# EAGLE design solarSwitch (EAGLE 9.6.2)
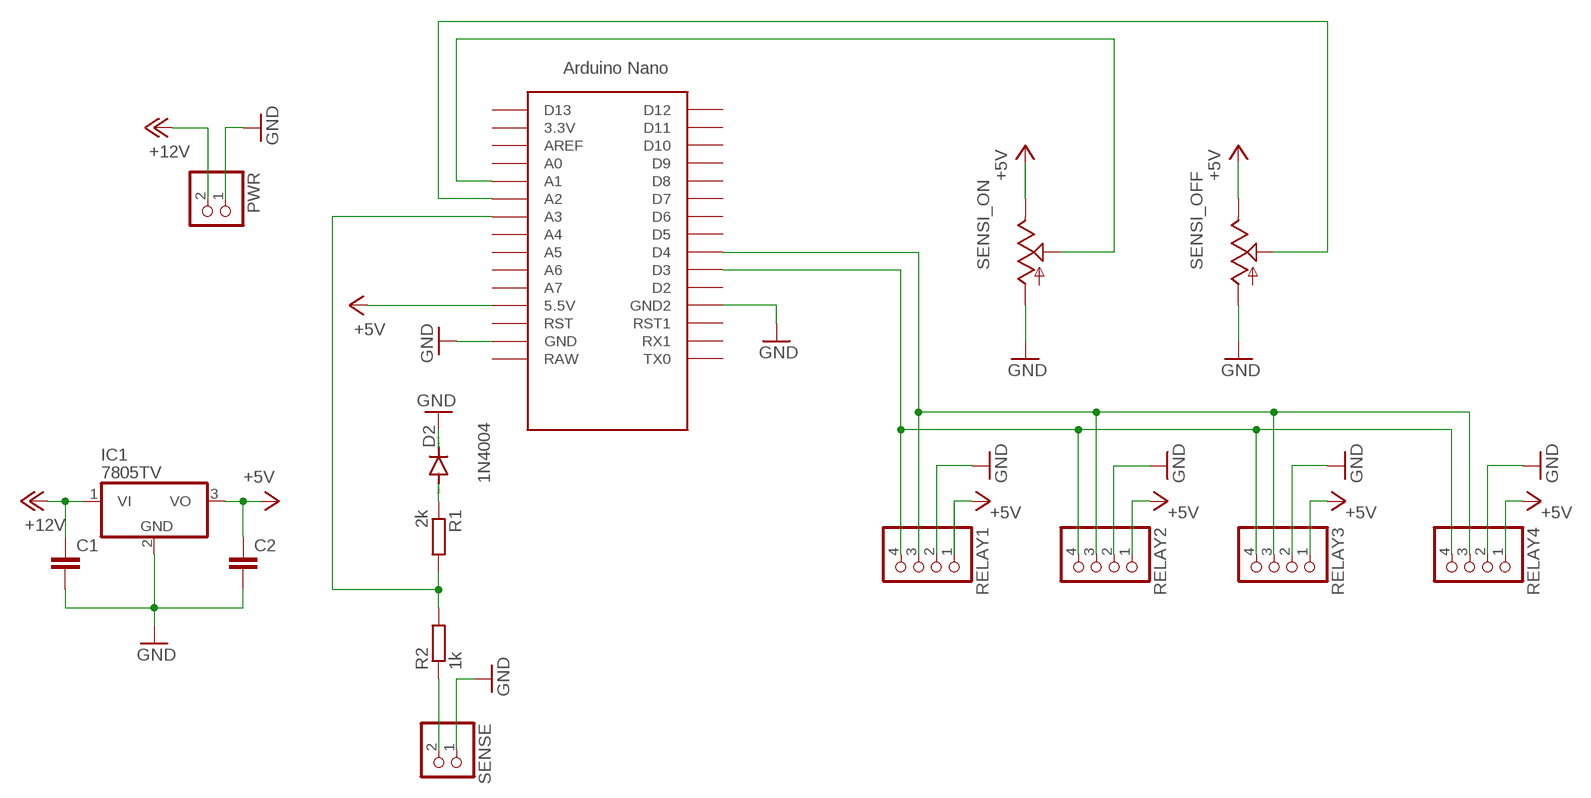
[diagram p0: schematic, sheet 1]

## Parts
C1  C5/3  [C5B3]
C2  C5/3  [C5B3]
D2  1N4004  [DO41-10]
IC1  7805TV  [TO220V]
PWR  PINHD-1X2  [1X02]
R1  2k  R-EU_0204/7  [0204/7]
R2  1k  R-EU_0204/7  [0204/7]
RELAY1  PINHD-1X4  [1X04]
RELAY2  PINHD-1X4  [1X04]
RELAY3  PINHD-1X4  [1X04]
RELAY4  PINHD-1X4  [1X04]
SENSE  PINHD-1X2  [1X02]
SENSI_OFF  TRIM_US-B25P  [B25P]
SENSI_ON  TRIM_US-B25P  [B25P]
U$1  NANO  [NANO]

## Nets
+5V: C2.1 IC1.3(VO) RELAY1.1 RELAY2.1 RELAY3.1 RELAY4.1 SENSI_OFF.E SENSI_ON.E U$1.5V(5.5V)
+12V: C1.1 IC1.1(VI) PWR.2
GND: C1.2 C2.2 D2.C IC1.2(GND) PWR.1 RELAY1.2 RELAY2.2 RELAY3.2 RELAY4.2 SENSE.1 SENSI_OFF.A SENSI_ON.A U$1.GND U$1.GND1(GND2)
N$1: SENSI_ON.S U$1.A1
N$2: R2.1 SENSE.2
N$3: D2.A R1.1
N$4: SENSI_OFF.S U$1.A2
N$5: RELAY1.3 RELAY2.3 RELAY3.3 RELAY4.3 U$1.D4
N$6: R1.2 R2.2 U$1.A3
N$8: RELAY1.4 RELAY2.4 RELAY3.4 RELAY4.4 U$1.D3
Unconnected: U$1.3.3V U$1.A0 U$1.A4 U$1.A5 U$1.A6 U$1.A7 U$1.AREF U$1.D2 U$1.D5 U$1.D6 U$1.D7 U$1.D8 U$1.D9 U$1.D10 U$1.D11 U$1.D12 U$1.D13 U$1.ICSP1 U$1.ICSP2 U$1.ICSP3 U$1.ICSP4 U$1.ICSP5 U$1.ICSP6 U$1.RAW U$1.RST U$1.RST1 U$1.RX1 U$1.TX0

## Library data of the parts
C1 C2 = capacitor-wima:C: CAPACITOR naming: grid - package width
D2 = diode:1N4004: DIODE general purpose rectifier, 1 A
IC1 = linear:78*: Positive VOLTAGE REGULATOR Source: http://cache.national.com/ds/LM/LM78L05.pdf http://www.fairchildsemi.com/ds/LM/LM7805.pdf
PWR SENSE = pinhead:PINHD-1X2: PIN HEADER
R1 R2 = rcl:R-EU_: RESISTOR, European symbol; SPICEPREFIX: R
RELAY1-RELAY4 = pinhead:PINHD-1X4: PIN HEADER
SENSI_OFF SENSI_ON = pot:TRIM_US-: POTENTIOMETER
U$1 = Arduino-clone:NANO: Arduino Nano

## Board
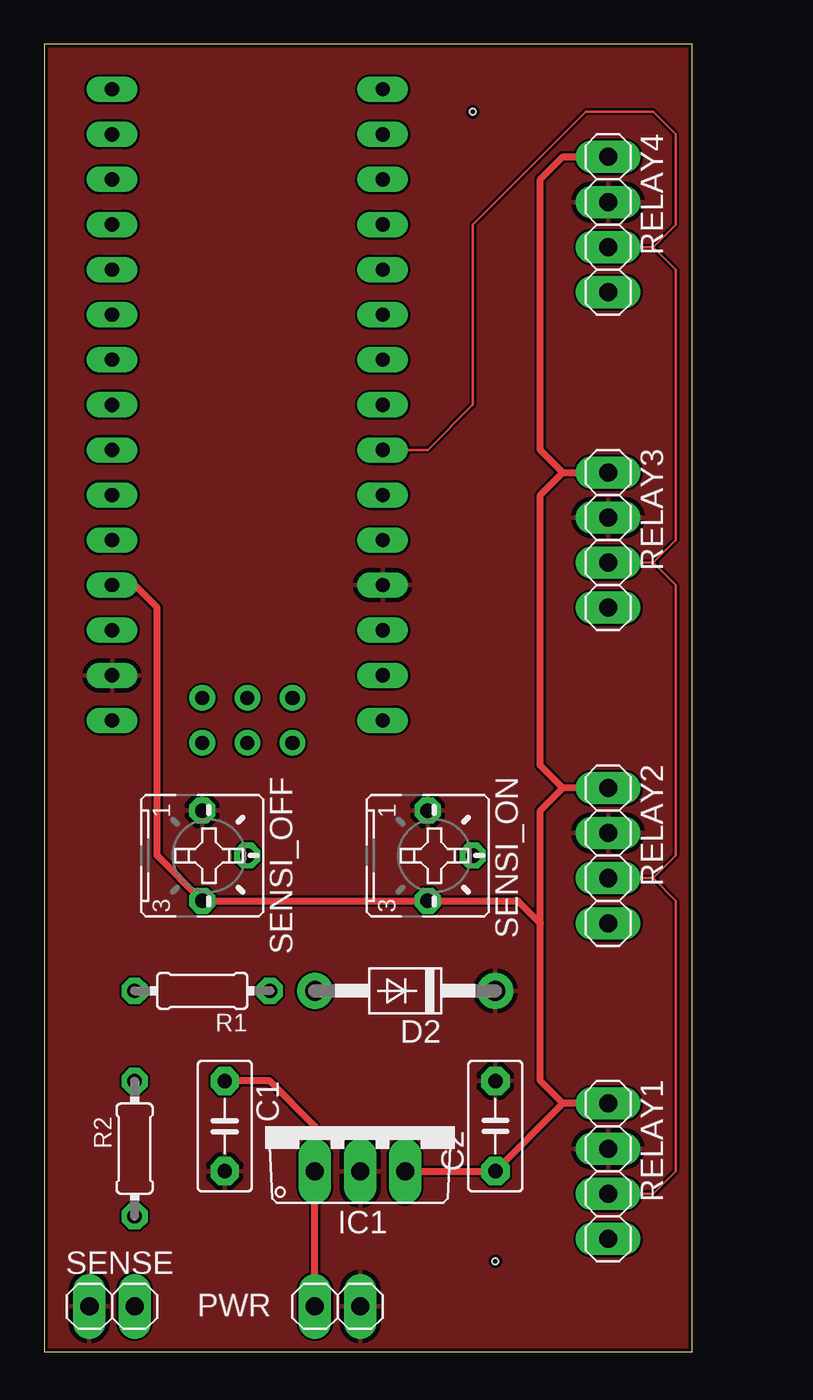
[diagram p1: board, top side]
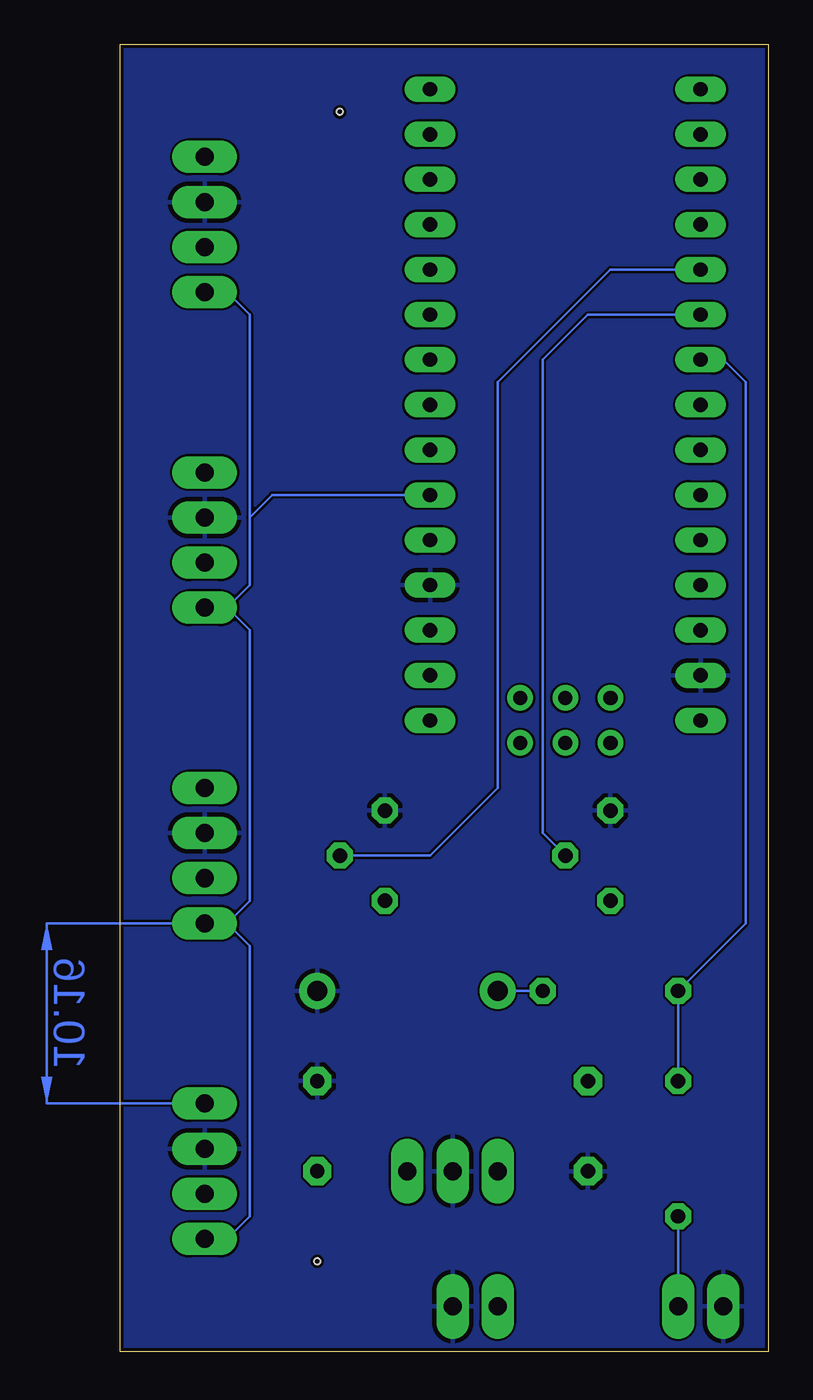
[diagram p2: board, bottom side, seen from below]

Size 36.5 x 73.65 mm. Coordinates in mm from the lower left corner, seen from the top.
Outline: 0,0 36.5,0 36.5,73.65 0,73.65 0,0
Copper layers (1*16): Top 0.035mm / dielectric 1.6mm / Bottom 0.035mm
Design rules "jlcpcb-2layers": minimum track width 5mil, minimum drill 0.3mm, track to track 5mil, track to pad 5mil, pad to pad 5mil, via to via 5mil, smd to smd 5mil, copper to edge 0.2mm, drill to drill 6mil, minimum pad ring 10mil, minimum via ring 3mil, stop-mask expansion 4mil, vias tented up to drill 0mil, thermal gap 10mil
Holes 0.35 mm at 24.13,69.85 25.4,5.08

### Footprints (pad centres in the part's own frame; a part is rotated, then mirrored left to right if it is on the bottom)
C5B3 = drill 0.813 pad 1.6 octagon: 1 -2.54,0; 2 2.54,0
DO41-10 = drill 1.118: A 5.08,0; C -5.08,0
TO220V = drill 1.016 long: 1 -2.54,-2.54; 2 0,-2.54; 3 2.54,-2.54
1X02 = drill 1.016 long: 1 -1.27,0; 2 1.27,0
0204/7 = drill 0.813 octagon: 1 -3.81,0; 2 3.81,0
1X04 = drill 1.016 long: 1 -3.81,0; 2 -1.27,0; 3 1.27,0; 4 3.81,0
B25P = drill 0.813 octagon: A -2.54,0; E 2.54,0; S 0,2.54
NANO = drill 0.8 long: 3.3V -10.16,24.13; 5V -10.16,-1.27; A0 -10.16,19.05; A1 -10.16,16.51; A2 -10.16,13.97; A3 -10.16,11.43; A4 -10.16,8.89; A5 -10.16,6.35; A6 -10.16,3.81; A7 -10.16,1.27; AREF -10.16,21.59; D2 5.08,1.27; D3 5.08,3.81; D4 5.08,6.35; D5 5.08,8.89; D6 5.08,11.43; D7 5.08,13.97; D8 5.08,16.51; D9 5.08,19.05; D10 5.08,21.59; D11 5.08,24.13; D12 5.08,26.67; D13 -10.16,26.67; GND -10.16,-6.35; GND1 5.08,-1.27; RAW -10.16,-8.89; RST -10.16,-3.81; RST1 5.08,-3.81; RX1 5.08,-6.35; TX0 5.08,-8.89 | drill 0.8: ICSP1 -5.08,-10.16; ICSP2 -5.08,-7.62; ICSP3 -2.54,-10.16; ICSP4 -2.54,-7.62; ICSP5 0,-10.16; ICSP6 0,-7.62

### Placement (x,y rotation side)
C1  10.16,12.7 270 top
C2  25.4,12.7 90 top
D2  20.32,20.32 180 top
IC1  17.78,12.7 0 top
PWR  16.51,2.54 180 top
R1  8.89,20.32 180 top
R2  5.08,11.43 90 top
RELAY1  31.75,10.16 270 top
RELAY2  31.75,27.94 270 top
RELAY3  31.75,45.72 270 top
RELAY4  31.75,63.5 270 top
SENSE  3.81,2.54 0 top
SENSI_OFF  8.89,27.94 270 top
SENSI_ON  21.59,27.94 270 top
U$1  13.97,44.45 0 top

### Tracks (layer width: path | path; a pad name or v marks a point on that pad's centre or on a via)
+5V
  Top 0.406: IC1.3 C2.1 29.21,13.97 | RELAY1.1 29.21,13.97 | 29.21,13.97 27.94,15.24 27.94,24.13 | 29.21,31.75 27.94,30.48 27.94,24.13 | RELAY2.1 29.21,31.75 | 29.21,31.75 27.94,33.02 27.94,48.26 29.21,49.53 | 29.21,49.53 RELAY3.1 | 29.21,49.53 27.94,50.8 27.94,66.04 29.21,67.31 RELAY4.1 | 27.94,24.13 26.67,25.4 SENSI_ON.E SENSI_OFF.E 6.35,27.94 6.35,41.91 5.08,43.18 U$1.5V
+12V
  Top 0.406: PWR.2 IC1.1 15.24,12.7 12.7,15.24 C1.1
GND
  pour Top: 0,73.66 36.83,73.66 36.83,0 0,0
  pour Bottom: 0,73.66 36.83,73.66 36.83,0 0,0
N$1
  Bottom 0.127: SENSI_ON.S 19.05,27.94 15.24,31.75 15.24,54.61 8.89,60.96 U$1.A1
N$2
  Bottom 0.127: SENSE.2 R2.1
N$3
  Bottom 0.127: R1.1 D2.A
N$4
  Bottom 0.127: SENSI_OFF.S 12.7,29.21 12.7,55.88 10.16,58.42 U$1.A2
N$5
  Top 0.127: RELAY4.3 34.29,62.23 | 34.29,62.23 35.56,63.5 35.56,68.58 34.29,69.85 30.48,69.85 24.13,63.5 24.13,53.34 21.59,50.8 U$1.D4 | 34.29,62.23 35.56,60.96 35.56,45.72 34.29,44.45 | RELAY3.3 34.29,44.45 | 34.29,44.45 35.56,43.18 35.56,27.94 34.29,26.67 | RELAY2.3 34.29,26.67 | 34.29,26.67 35.56,25.4 35.56,10.16 34.29,8.89 RELAY1.3
N$6
  Bottom 0.127: R2.2 R1.2 1.27,24.13 1.27,54.61 2.54,55.88 U$1.A3
N$8
  Bottom 0.127: RELAY4.4 30.48,59.69 29.21,58.42 29.21,46.99 | 29.21,46.99 29.21,43.18 30.48,41.91 | U$1.D3 27.94,48.26 29.21,46.99 | RELAY3.4 30.48,41.91 | 30.48,41.91 29.21,40.64 29.21,25.4 30.48,24.13 | RELAY2.4 30.48,24.13 | 30.48,24.13 29.21,22.86 29.21,7.62 30.48,6.35 RELAY1.4
(copper drawn outside any net)
  shapes: Bottom area x1